# EAGLE design Lick Sensor module v1.0 (EAGLE 9.6.2)
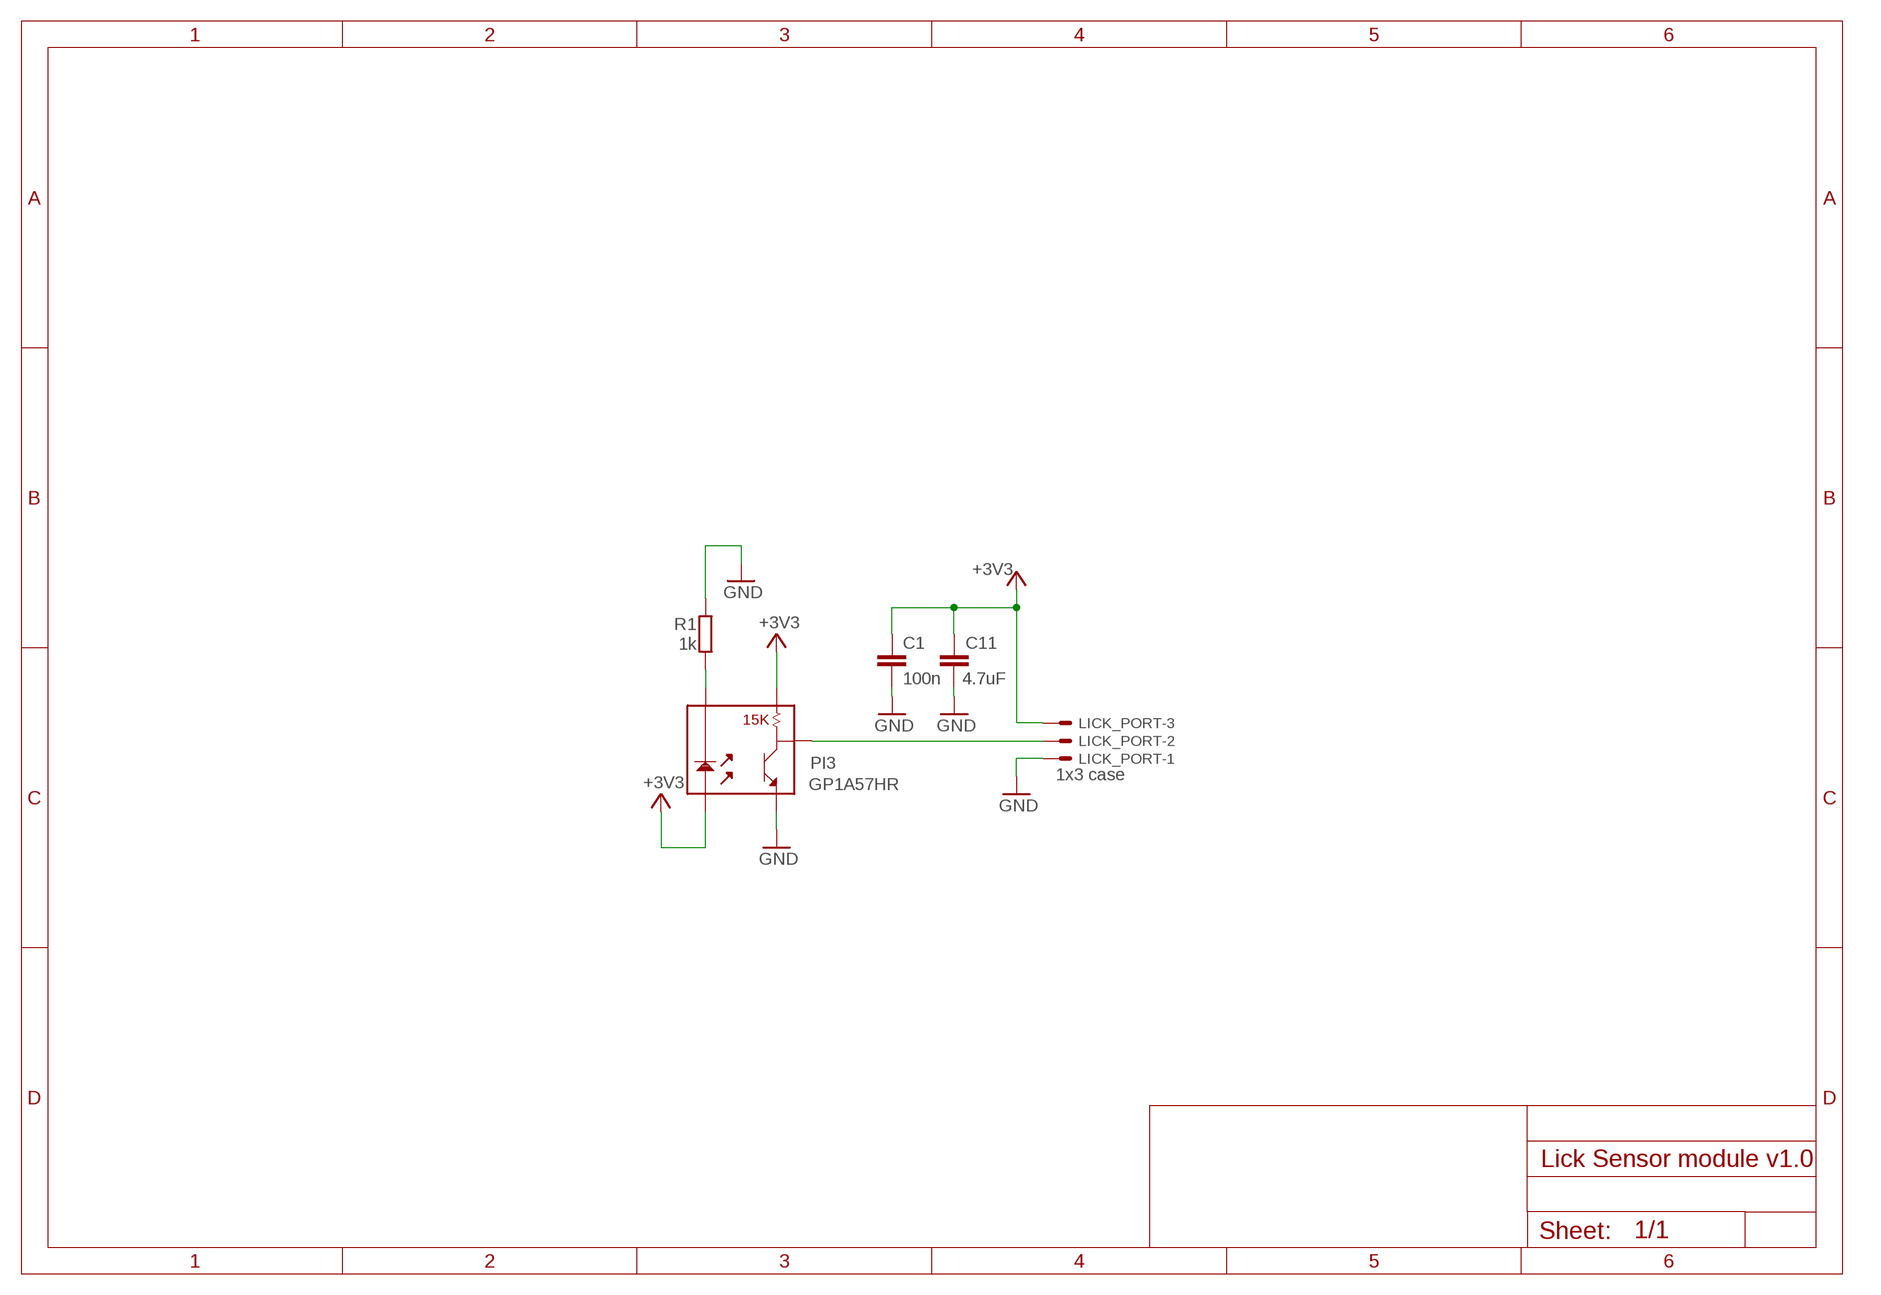
[diagram p0: schematic, sheet 1]

## Parts
C1  100n  C-EUC0402K  [C0402K]
C11  4.7uF  C-EUC0603  [C0603]
LICK_PORT  1x3 case  22-23-2031  [22-23-2031]
PI3  GP1A57HR  [GP1A57HR]
R1  1k  R-EU_R0603  [R0603]

## Nets
+3V3: C1.1 C11.1 LICK_PORT.3 PI3.1 PI3.3
GND: C1.2 C11.2 LICK_PORT.1 PI3.5 R1.2
N$1: LICK_PORT.2 PI3.4
N$2: PI3.2 R1.1

## Library data of the parts
C1 = rcl:C-EU: CAPACITOR, European symbol; MPN: GRM155R71E104KE14D; OEPS: OEPS010004
C11 = rcl:C-EU: CAPACITOR, European symbol; MPN: C1608X6S1C475K080AC; OEPS: OEPS010018; SPICEPREFIX: C
LICK_PORT = con-molex:22-23-2031: .100" (2.54mm) Center Header - 3 Pin; MF: MOLEX; MPN: 282834-3; OC_FARNELL: 1462950; OC_NEWARK: 30C0862; OEPS: OEPS070035
PI3 = SparkFun:GP1A57HR; DESCRIPTION: SENSOR OPTICAL 10MM PCB MOUNT; MPN: GP1A57HRJ00F; OEPS: OEPSK01022
R1 = rcl:R-EU_: RESISTOR, European symbol; MPN: ERJ-2RKF1001X; OEPS: OEPS020006

## Board
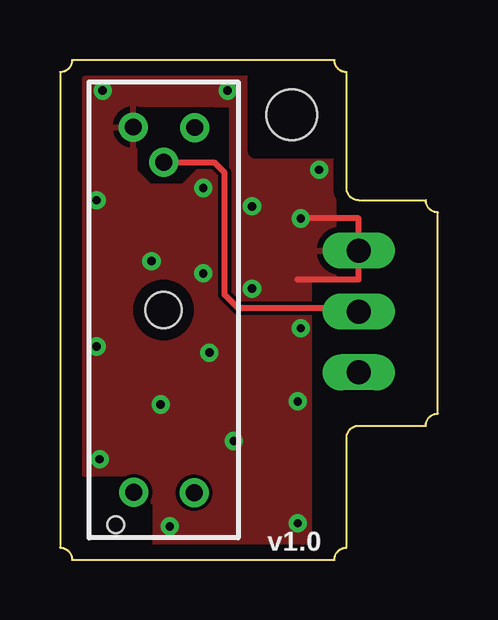
[diagram p1: board, top side]
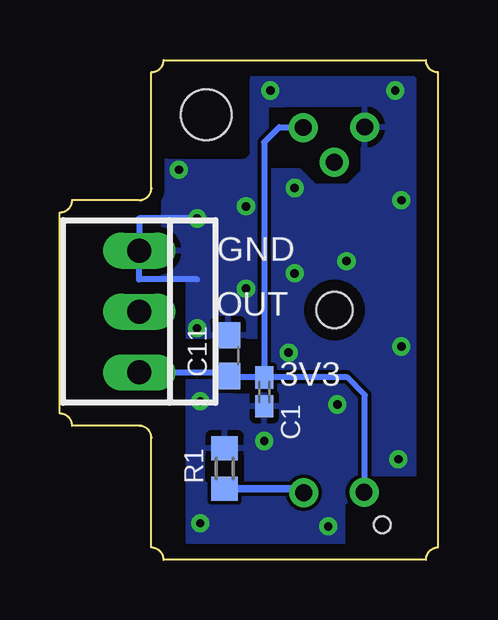
[diagram p2: board, bottom side, seen from below]

Size 15.75 x 20.83 mm. Coordinates in mm from the lower left corner, seen from the top.
Outline: 0.51,0 11.43,0 arc-90 11.94,0.51 11.94,5.08 arc-90 12.45,5.59 15.24,5.59 arc-90 15.75,6.1 15.75,14.48 arc-90 15.24,14.99 12.45,14.99 arc-90 11.94,15.49 11.94,20.32 arc-90 11.43,20.83 0.51,20.83 arc-90 0,20.32 0,0.51 arc-90 0.51,0
Copper layers (1*16): Top 0.035mm / dielectric 1.5mm / Bottom 0.035mm
Design rules "default *": minimum track width 6mil, minimum drill 0.35mm, track to track 6mil, track to pad 6mil, pad to pad 6mil, via to via 6mil, smd to smd 6mil, copper to edge 20mil, drill to drill 6mil, minimum pad ring 10mil, minimum via ring 8mil, stop-mask expansion 4mil, vias tented up to drill 0mil, thermal gap 10mil
Holes 2.1 mm at 9.65,18.54

### Footprints (pad centres in the part's own frame; a part is rotated, then mirrored left to right if it is on the bottom)
C0402K = smd 0.925 x 0.74: 1 -0.6,0; 2 0.6,0
C0603 = smd 1.1 x 1: 1 -0.85,0; 2 0.85,0
22-23-2031 = drill 1 long: 1 -2.54,0; 2 0,0; 3 2.54,0
GP1A57HR = drill 0.7: 1 -7.6,1.24; 2 -7.62,-1.27; 3 7.6,-1.3; 4 6.15,0; 5 7.62,1.27 | hole 1.5: 0,0 | hole 0.7: -8.95,2
R0603 = smd 1 x 1.1: 1 -0.85,0; 2 0.85,0

### Placement (x,y rotation side)
C1  7.24,7 270 bottom
C11  8.75,8.51 90 bottom
LICK_PORT  12.45,10.35 270 bottom
PI3  4.32,10.41 90 top
R1  8.89,3.81 90 bottom

### Tracks (layer width: path | path; a pad name or v marks a point on that pad's centre or on a via)
+3V3
  Bottom 0.254: LICK_PORT.3 8.75,7.81 C11.1 8.75,7.6 C1.1 | C1.1 7.24,17.4 6.6,18.03 5.64,18.03 PI3.3 | PI3.1 3.05,2.81 3.05,6.86 3.81,7.62 7.24,7.62 C1.1
GND  (via drill 0.35)
  Top 0.254: 9.91,11.68 12.45,11.68 12.45,14.22 9.91,14.22
  Bottom 0.254: 10.03,11.68 12.45,11.68 LICK_PORT.1 12.45,14.22 v10.03,14.22
  other vias: 4.57,1.4 1.65,4.19 1.52,8.89 6.99,19.56 1.52,14.99 4.19,6.48 1.78,19.56 9.91,1.52 8,14.73 10.03,9.65 10.79,16.26 6.22,8.64 3.81,12.45 8,11.3 9.91,6.6 5.97,15.49 7.24,4.95 5.97,11.94
  pour Bottom: 1.02,0.76 10.41,0.76 10.41,11.68 11.43,11.68 11.43,20.07 1.02,20.07
  pour Top: 1.02,0.76 10.41,0.76 10.41,11.68 11.43,11.68 11.43,20.07 1.02,20.07
N$1
  Top 0.254: PI3.4 6.42,16.56 6.86,16.13 6.86,11.05 7.43,10.48 12.31,10.48 LICK_PORT.2
N$2
  Bottom 0.305: PI3.2 5.59,2.96 R1.1
N$3
  cutout Top: 1.02,3.43 2.79,3.43 2.79,2.41 1.02,2.41
N$4
  cutout Bottom: 1.02,3.43 2.79,3.43 2.79,2.41 1.02,2.41
N$5
  cutout Bottom: 2.79,0.51 2.79,2.29 3.81,2.29 3.81,0.51
N$6
  cutout Bottom: 8.13,4.32 9.65,4.32 9.65,3.3 8.13,3.3
N$7
  cutout Bottom: 3.3,18.8 6.35,18.8 6.35,17.02 5.08,15.75 3.81,15.75 3.3,16.26
N$8
  cutout Top: 3.3,18.8 6.35,18.8 6.35,17.02 5.08,15.75 3.81,15.75 3.3,16.26
N$9
  cutout Top: 6.99,16.38 5.84,16.38 5.84,18.8 6.99,18.8
N$10
  cutout Top: 2.79,0.51 2.79,2.29 3.81,2.29 3.81,0.51
N$11
  cutout Bottom: 10.54,8.13 7.62,8.13 7.62,9.14 10.54,9.14
N$12
  cutout Bottom: 8.51,6.99 7.75,6.99 7.75,7.37 8.51,7.37
N$13
  cutout Bottom: 6.99,16.38 5.84,16.38 5.84,18.8 6.99,18.8
X
  cutout Top: 11.43,17.02 arc-90 11.18,16.76 8.13,16.76 arc-90 7.87,17.02 7.87,20.07 arc-90 8.13,20.32 11.18,20.32 arc-90 11.43,20.07
X1
  cutout Bottom: 11.43,17.02 arc-90 11.18,16.76 8.13,16.76 arc-90 7.87,17.02 7.87,20.07 arc-90 8.13,20.32 11.18,20.32 arc-90 11.43,20.07

### Text on the board
tPlace: v1.0
bNames: GND | OUT | 3V3